# EAGLE design LDBiasDriver CC (EAGLE 7.7.0)
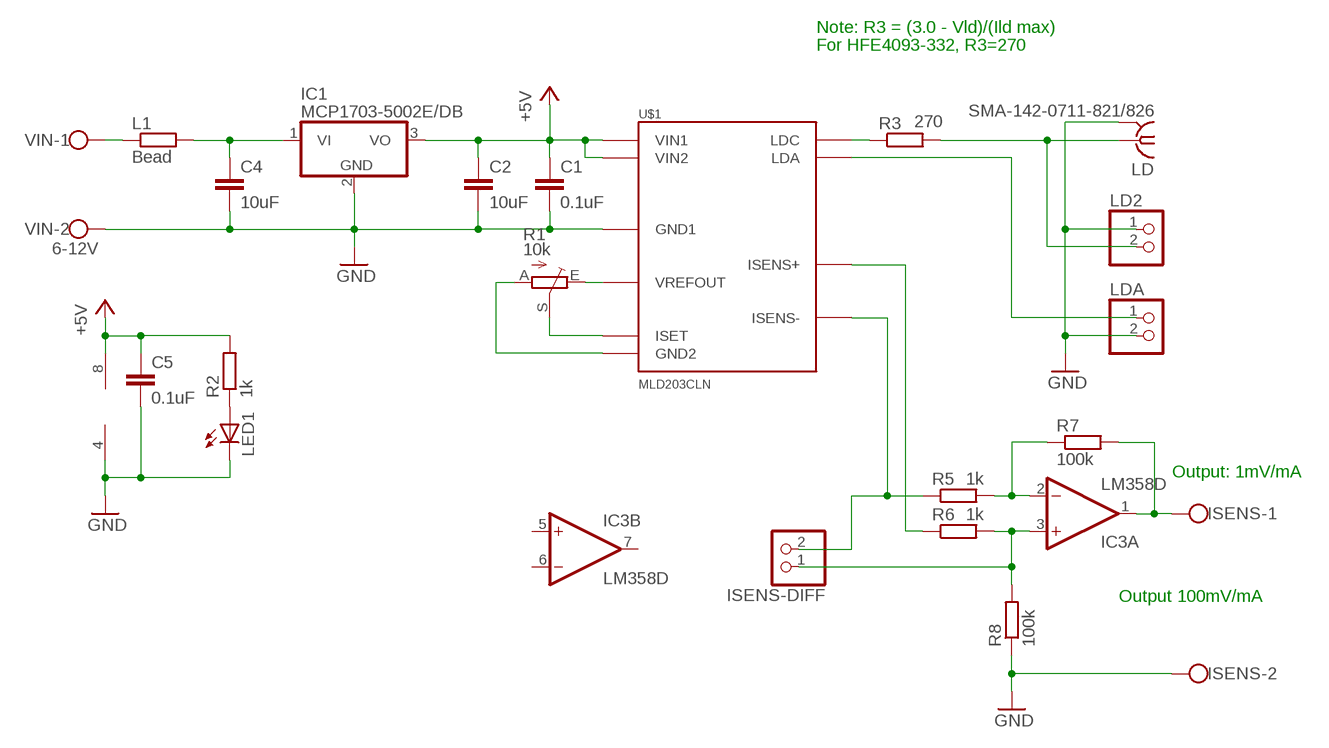
[diagram p0: schematic, sheet 1]

## Parts
C1  0.1uF  C-EUC0805  [C0805]
C2  10uF  C-EUC0805  [C0805]
C4  10uF  C-EUC0805  [C0805]
C5  0.1uF  C-EUC0805  [C0805]
IC1  MCP1703-5002E/DB  MCP1703DB  [SOT223]
IC3  LM358D  [SO08]
ISENS  W237-102  [W237-102]
ISENS-DIFF  PINHD-1X2  [1X02]
L1  Bead  R-EU_R0805  [R0805]
LD  SMA-142-0711-821/826  [J502-ND-142-0711-821/826]
LD2  PINHD-1X2  [1X02]
LDA  PINHD-1X2  [1X02]
LED1  LEDCHIPLED_1206  [CHIPLED_1206]
R1  10k  TRIM_EU-RJ9W  [RJ9W]
R2  1k  R-EU_R0805  [R0805]
R3  270  R-EU_R0805  [R0805]
R5  1k  R-EU_R0805  [R0805]
R6  1k  R-EU_R0805  [R0805]
R7  100k  R-EU_R0805  [R0805]
R8  100k  R-EU_R0805  [R0805]
U$1  MLD203CLN  [MLD203]
VIN  6-12V  W237-102  [W237-102]

## Nets
+5V: C1.1 C2.1 C5.1 IC1.3(VO) IC3.8(P:V+) R2.2 U$1.P$1(VIN1) U$1.P$2(VIN2)
GND: C1.2 C2.2 C4.2 C5.2 IC1.2(GND) IC3.4(P:V-) ISENS.2 LD2.1 LD.G@1 LD.G@2 LD.G@3 LD.G@4 LDA.2 LED1.C R8.1 U$1.P$3(GND1) VIN.2
N$2: R1.E U$1.P$5(VREFOUT)
N$3: LED1.A R2.1
N$4: R1.S U$1.P$6(ISET)
N$5: R1.A U$1.P$4(GND2)
N$6: R6.1 U$1.P$12(ISENS+)
N$7: ISENS-DIFF.2 R5.1 U$1.P$13(ISENS-)
N$8: LD2.2 LD.1 R3.2
N$9: R3.1 U$1.P$11(LDC)
N$11: LDA.1 U$1.P$14(LDA)
N$14: L1.1 VIN.1
N$15: C4.1 IC1.1(VI) L1.2
N$16: IC3.2(A:-IN) R5.2 R7.1
N$17: IC3.3(A:+IN) ISENS-DIFF.1 R6.2 R8.2
N$18: IC3.1(A:OUT) ISENS.1 R7.2
Unconnected: IC3.5(B:+IN) IC3.6(B:-IN) IC3.7(B:OUT)

## Notes on the sheet
- Note: R3 = (3.0 - Vld)/(Ild max)
- For HFE4093-332, R3=270
- Output: 1mV/mA
- Output 100mV/mA

## Library data of the parts
C1 C2 C4 C5 = rcl:C-EU: CAPACITOR, European symbol
IC1 = linear:MCP1703: 250 mA, 16V, Low Quiescent Current LDO Regulator Source: http://ww1.microchip.com/downloads/en/DeviceDoc/22049b.pdf
IC3 = linear:LM358: OP AMP also LM158; LM258; LM2904 Source: http://cache.national.com/ds/LM/LM158.pdf
ISENS VIN = con-wago-500:W237-102: WAGO SCREW CLAMP; MPN: 237-102; OC_FARNELL: unknown; OC_NEWARK: 70K9898
ISENS-DIFF LD2 LDA = pinhead:PINHD-1X2: PIN HEADER
L1 R2 R3 R5-R8 = rcl:R-EU_: RESISTOR, European symbol
LD = con-coax:SMA-: SMA 50 Ohm End Launch Jack Receptacle - Round Contact Johnson Components Source: www.johnsoncomponents.com .. J502-ND.pdf; MF: JOHNSON COMPONENTS; MPN: 142-0711-821; OC_FARNELL: 1019328; OC_NEWARK: 16F3627
LED1 = led:LED: LED OSRAM: - CHIPLED LG R971, LG N971, LY N971, LG Q971, LY Q971, LO R971, LY R971 LH N974, LH R974 LS Q976, LO Q976, LY Q976 LO Q996 - Hyper CHIPLED LW Q18S LB Q993, LB Q99A, LB R99A - SideLED LS A670, LO A670, LY A670, LG A670, LP A670 LB A673, LV A673, LT A673, LW A673 LH A674 LY A675 LS A676, LA A676, LO A676, LY A676, LW A676 LS A679, LY A679, LG A679 - Hyper Micro SIDELED® LS Y876, LA Y876, LO Y876, LY Y876 LT Y87S - SmartLED LW L88C, LW L88S LB L89C, LB L89S, LG L890 LS L89K, LO L89K, LY L89K LS L896, LA L896, LO L896, LY L896 - TOPLED LS T670, LO T670, LY T670, LG T670, LP T670 LSG T670, LSP T670, LSY T670, LOP T670, LYG T670 LG T671, LOG T671, LSG T671 LB T673, LV T673, LT T673, LW T673 LH T674 LS T676, LA T676, LO T676, LY T676, LB T676, LH T676, LSB T676, LW T676 LB T67C, LV T67C, LT T67C, LS T67K, LO T67K, LY T67K, LW E67C LS E67B, LA E67B, LO E67B, LY E67B, LB E67C, LV E67C, LT E67C LW T67C LS T679, LY T679, LG T679 LS T770, LO T770, LY T770, LG T770, LP T770 LB T773, LV T773, LT T773, LW T773 LH T774 LS E675, LA E675, LY E675, LS T675 LS T776, LA T776, LO T776, LY T776, LB T776 LHGB T686 LT T68C, LB T68C - Hyper Mini TOPLED® LB M676 - Mini TOPLED Santana® LG M470 LS M47K, LO M47K, LY M47K Source: http://www.osram.convergy.de LUXEON: - LUMILED® LXK2-PW12-R00, LXK2-PW12-S00, LXK2-PW14-U00, LXK2-PW14-V00 LXK2-PM12-R00, LXK2-PM12-S00, LXK2-PM14-U00 LXK2-PE12-Q00, LXK2-PE12-R00, LXK2-PE12-S00, LXK2-PE14-T00, LXK2-PE14-U00 LXK2-PB12-K00, LXK2-PB12-L00, LXK2-PB12-M00, LXK2-PB14-N00, LXK2-PB14-P00, LXK2-PB14-Q00 LXK2-PR12-L00, LXK2-PR12-M00, LXK2-PR14-Q00, LXK2-PR14-R00 LXK2-PD12-Q00, LXK2-PD12-R00, LXK2-PD12-S00 LXK2-PH12-R00, LXK2-PH12-S00 LXK2-PL12-P00, LXK2-PL12-Q00, LXK2-PL12-R00 Source: www.luxeon.com KINGBRIGHT: KA-3528ASYC Source: www.kingbright.com
R1 = pot:TRIM_EU-: POTENTIOMETER
U$1 = laser diode:MLD203CLN

## Board
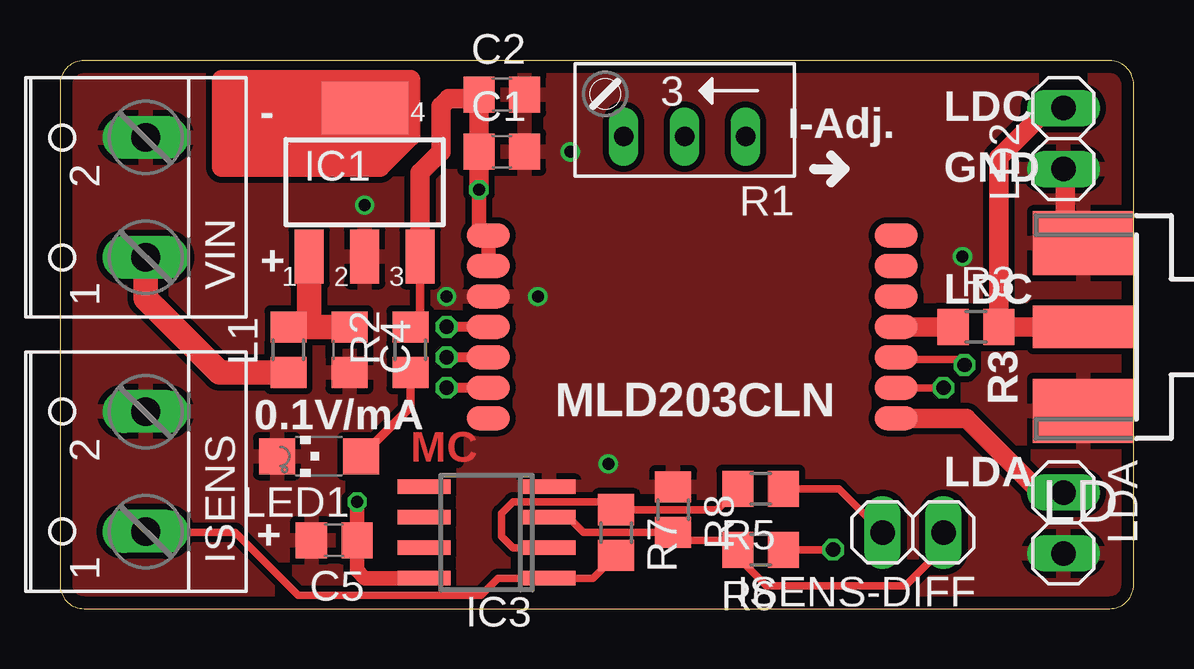
[diagram p1: board, top side]
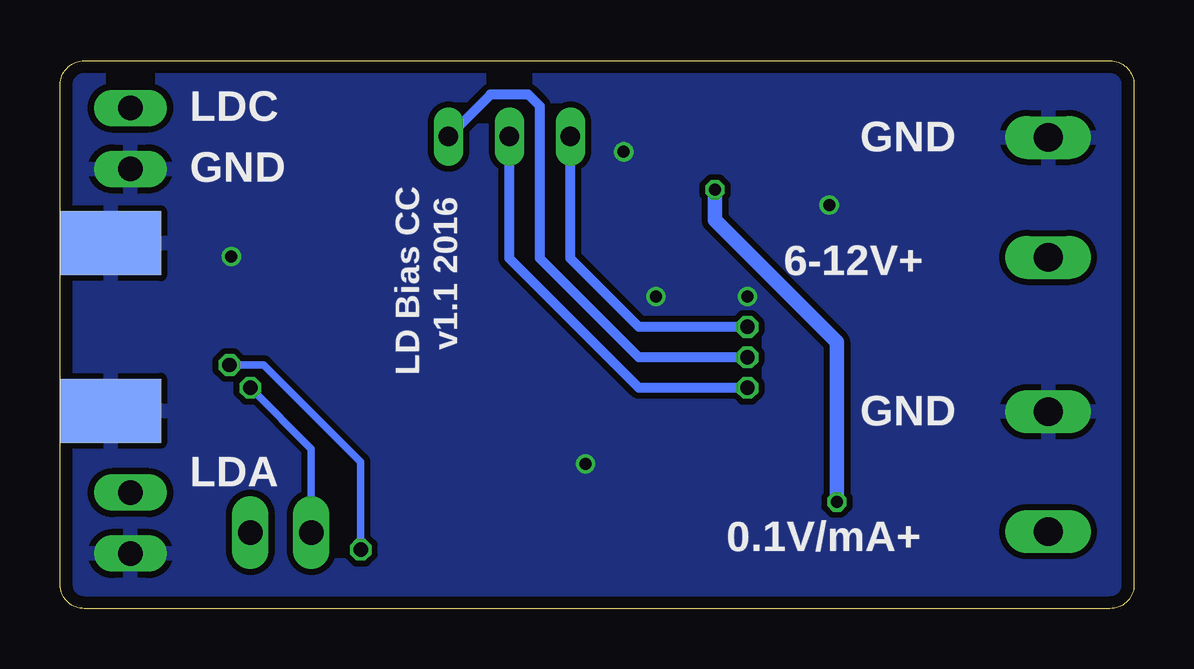
[diagram p2: board, bottom side, seen from below]

Size 44.77 x 22.85 mm. Coordinates in mm from the lower left corner, seen from the top.
Outline: 0,21.85 0,1 arc90 1,0 43.76,0 arc90 44.76,1 44.76,21.85 arc90 43.76,22.85 1,22.85 arc90 0,21.85
Copper layers (1*16): Top 0.035mm / dielectric 1.6mm / Bottom 0.035mm
Design rules "Elecrow_2-layer_PCB_eagle_rule *": minimum track width 6mil, minimum drill 12mil, track to track 10mil, track to pad 10mil, pad to pad 10mil, via to via 10mil, smd to smd 10mil, copper to edge 20mil, drill to drill 10mil, minimum pad ring 6mil, minimum via ring 6mil, stop-mask expansion 0mil, vias tented up to drill 100mil, thermal gap 10mil

### Footprints (pad centres in the part's own frame; a part is rotated, then mirrored left to right if it is on the bottom)
C0805 = smd 1.3 x 1.5: 1 -0.95,0; 2 0.95,0
SOT223 = smd 1.219 x 2.235: 1 -2.311,-3.099; 2 0,-3.099; 3 2.311,-3.099 | smd 3.6 x 2.2: 4 0,3.099
SO08 = smd 0.6 x 2.2: 1 -1.905,-2.6; 2 -0.635,-2.6; 3 0.635,-2.6; 4 1.905,-2.6; 5 1.905,2.6; 6 0.635,2.6; 7 -0.635,2.6; 8 -1.905,2.6
W237-102 = drill 1.194 long: 1 -2.5,-1.27; 2 2.5,-1.27
1X02 = drill 1.016 long: 1 -1.27,0; 2 1.27,0
R0805 = smd 1.3 x 1.5: 1 -0.95,0; 2 0.95,0
J502-ND-142-0711-821/826 = smd 4.191 x 1.778: 1 2.115,0 | smd 4.191 x 2.667: G@1 2.115,3.495; G@2 2.115,-3.495 | smd 4.191 x 2.667 bottom: G@3 2.115,3.495; G@4 2.115,-3.495
CHIPLED_1206 = smd 1.5 x 1.5: A 0,-1.75; C 0,1.75
RJ9W = drill 0.813 long: A 2.54,0.635; E -2.54,0.635; S 0,0.635
MLD203 = smd 1.8 x 1: P$1 0,0; P$2 0,-1.27; P$3 0,-2.54; P$4 0,-3.81; P$5 0,-5.08; P$6 0,-6.35; P$7 0,-7.62; P$8 17,0; P$9 17,-1.27; P$10 17,-2.54; P$11 17,-3.81; P$12 17,-5.08; P$13 17,-6.35; P$14 17,-7.62

### Placement (x,y rotation side)
C1  18.41,19.05 0 top
C2  18.41,21.43 0 top
C4  12.06,10.79 270 top
C5  11.43,2.86 180 top
IC1  12.7,17.78 0 top
IC3  17.78,3.17 90 top
ISENS  2.3,5.71 90 top
ISENS-DIFF  35.56,3.17 180 top
L1  9.53,10.79 90 top
LD  44.77,11.75 180 top
LD2  41.83,19.61 90 top
LDA  41.83,3.57 270 top
LED1  10.79,6.35 90 top
R1  26.04,20.32 180 top
R2  14.61,10.79 90 top
R3  38.18,11.75 0 top
R5  29.21,5 180 top
R6  29.21,2.46 180 top
R7  23.18,3.17 270 top
R8  25.56,4.13 270 top
U$1  17.86,15.56 0 top
VIN  2.3,17.14 90 top

### Tracks (layer width: path | path; a pad name or v marks a point on that pad's centre or on a via)
+5V  (via drill 0.5)
  Top 0.356: IC1.3 15.01,12.15
  Top 0.61: 15.01,12.15 R2.2 | IC3.8 12.7,1.27 12.38,1.59 C5.1 12.7,3.18 12.38,3.5 v12.38,4.45 | U$1.P$2 U$1.P$1 17.46,15.95 v17.46,17.46
  Top 0.813: IC1.3 15.01,18.19 15.88,19.05 15.88,20.95 16.19,21.27 17.31,21.27 C2.1 C1.1 v17.46,17.46
  Bottom 0.61: v17.46,17.46 17.46,16.19 12.38,11.11 v12.38,4.45
GND  (via drill 0.5)
  Top 0.813: LD2.1 41.91,18.34 41.91,15.24 LD.G@2
  other vias: 21.27,19.05 22.86,6.03 12.7,16.83 16.11,13.02 19.92,13.02 37.62,14.68
  pour Top: 0,22.86 44.69,22.86 44.69,0 -1.27,0
  pour Bottom: 0,22.86 44.85,22.86 44.85,-0.08 -1.27,-1.35
N$1
  Top 0.813: 13.97,21.59 6.75,21.59 | 6.75,21.59 6.75,18.41 13.34,18.41 14.61,19.68 14.61,22.07 6.75,22.07 6.75,21.59
N$2  (via drill 0.6)
  Top 0.406: U$1.P$5 v16.11,10.48
  Bottom 0.406: v16.11,10.48 20.64,10.48 24.77,14.61 24.77,20.95 25.24,21.43 26.83,21.43 R1.E
N$3
  Top 0.356: R2.1 14.61,8.41 LED1.A
N$4  (via drill 0.6)
  Top 0.406: U$1.P$6 v16.11,9.21
  Bottom 0.406: v16.11,9.21 20.64,9.21 26.04,14.61 R1.S
N$5  (via drill 0.6)
  Top 0.406: U$1.P$4 v16.11,11.75
  Bottom 0.406: v16.11,11.75 20.64,11.75 23.5,14.61 R1.A
N$6  (via drill 0.6)
  Top 0.305: U$1.P$12 34.94,10.4 37.47,10.4 v37.7,10.16 | v32.23,2.46 R6.1
  Bottom 0.305: v37.7,10.16 36.27,10.16 32.23,6.11 v32.23,2.46
N$7  (via drill 0.6)
  Top 0.305: R5.1 32.46,5 ISENS-DIFF.2 | U$1.P$13 v36.83,9.21
  Bottom 0.305: v36.83,9.21 34.29,6.67 ISENS-DIFF.2
N$8
  Top 0.813: LD.1 R3.2 39.13,18.81 41.2,20.88 LD2.2
N$9
  Top 0.813: U$1.P$11 R3.1
N$11
  Top 0.813: U$1.P$14 37.78,7.94 40.64,5.08 41.59,5.08 LDA.1
N$14
  Top 1.016: VIN.1 3.57,12.94 6.67,9.85 L1.1
N$15
  Top 1.016: L1.2 10.16,11.74 | 10.16,11.74 C4.1 | IC1.1 10.39,11.97 10.16,11.74
N$16
  Top 0.305: R5.2 27.38,4.12 R7.1 22.86,4.12 22.54,4.45 18.89,4.45 18.41,3.97 18.41,3.02 18.89,2.54 IC3.2
N$17
  Top 0.305: 28.42,1.98 29.45,0.95 35.24,0.95 36.83,2.54 | R6.2 27.78,2.86 25.8,2.86 R8.2 21.83,3.18 21.19,3.81 IC3.3
  Top 0.356: R6.2 28.26,2.85 28.42,1.98 | 36.83,2.54 ISENS-DIFF.1
  Top 0.61: R8.2 25.72,2.86
N$18
  Top 0.305: 3.85,3.17 7.3,3.17 9.92,0.56 17.54,0.56 18.26,1.27 IC3.1 22.22,1.27 R7.2
  Top 0.356: 3.85,3.17 ISENS.1
N$19
  Top 0.813: 7.38,20.95 12.06,20.95 11.43,20.32 7.38,20.4 7.38,19.05 13.34,19.05 13.97,19.68 | 13.97,19.68 14.29,19.68 | 13.97,19.68 7.94,19.68

### Text on the board
Top: MC
tStop: MC
bStop: Mitchell A. Cox
tSilk: - | I-Adj. | LDC | GND | + | LDC | R3 | MLD203CLN | 0.1V/mA | LDA | +
bSilk: LDC | GND | LD Bias CC | GND | v1.1 2016 | 6-12V+ | GND | LDA | 0.1V/mA+